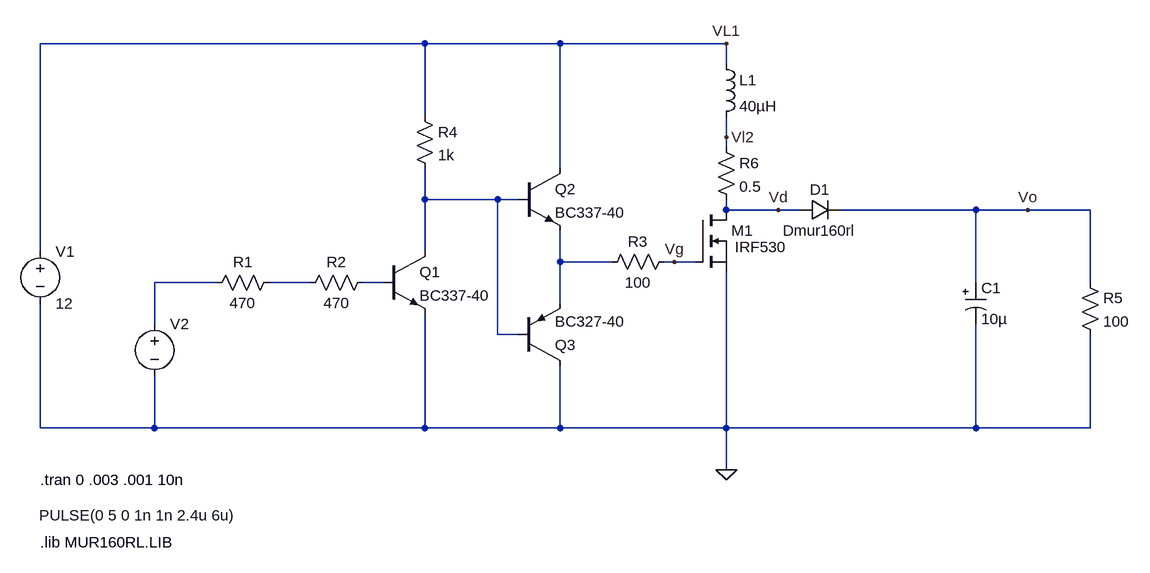
[diagram p0: schematic 3b.asc]
3b.asc, the LTspice schematic file:
Version 4
SHEET 1 1664 680
WIRE 544 -224 -48 -224
WIRE 752 -224 544 -224
WIRE 1008 -224 752 -224
WIRE 1008 -192 1008 -224
WIRE 544 -112 544 -224
WIRE 1008 -80 1008 -112
WIRE 1008 -64 1008 -80
WIRE 752 -32 752 -224
WIRE 544 16 544 -32
WIRE 656 16 544 16
WIRE 688 16 656 16
WIRE 1008 32 1008 16
WIRE 1088 32 1008 32
WIRE 1120 32 1088 32
WIRE 1392 32 1184 32
WIRE 1472 32 1392 32
WIRE 1568 32 1472 32
WIRE 1008 48 1008 32
WIRE -48 96 -48 -224
WIRE 544 96 544 16
WIRE 752 112 752 64
WIRE 832 112 752 112
WIRE 928 112 912 112
WIRE 960 112 928 112
WIRE 224 144 128 144
WIRE 368 144 304 144
WIRE 480 144 448 144
WIRE 1392 144 1392 32
WIRE 1568 144 1568 32
WIRE 752 176 752 112
WIRE 128 208 128 144
WIRE 656 224 656 16
WIRE 688 224 656 224
WIRE -48 368 -48 176
WIRE 128 368 128 288
WIRE 128 368 -48 368
WIRE 544 368 544 192
WIRE 544 368 128 368
WIRE 752 368 752 272
WIRE 752 368 544 368
WIRE 1008 368 1008 128
WIRE 1008 368 752 368
WIRE 1392 368 1392 208
WIRE 1392 368 1008 368
WIRE 1568 368 1568 224
WIRE 1568 368 1392 368
WIRE 1008 432 1008 368
FLAG 1008 432 0
FLAG 1008 -80 Vl2
FLAG 1472 32 Vo
FLAG 1008 -224 VL1
FLAG 928 112 Vg
FLAG 1088 32 Vd
SYMBOL voltage -48 80 R0
WINDOW 123 0 0 Left 0
WINDOW 39 0 0 Left 0
SYMATTR InstName V1
SYMATTR Value 12
SYMBOL voltage 128 192 R0
WINDOW 3 -178 310 Left 2
WINDOW 123 0 0 Left 0
WINDOW 39 0 0 Left 0
SYMATTR Value PULSE(0 5 0 1n 1n 2.4u 6u)
SYMATTR InstName V2
SYMBOL res 320 128 R90
WINDOW 0 0 56 VBottom 2
WINDOW 3 32 56 VTop 2
SYMATTR InstName R1
SYMATTR Value 470
SYMBOL res 464 128 R90
WINDOW 0 0 56 VBottom 2
WINDOW 3 32 56 VTop 2
SYMATTR InstName R2
SYMATTR Value 470
SYMBOL res 928 96 R90
WINDOW 0 0 56 VBottom 2
WINDOW 3 32 56 VTop 2
SYMATTR InstName R3
SYMATTR Value 100
SYMBOL res 528 -128 R0
SYMATTR InstName R4
SYMATTR Value 1k
SYMBOL res 1552 128 R0
SYMATTR InstName R5
SYMATTR Value 100
SYMBOL npn 480 96 R0
SYMATTR InstName Q1
SYMATTR Value BC337-40
SYMBOL npn 688 -32 R0
SYMATTR InstName Q2
SYMATTR Value BC337-40
SYMBOL pnp 688 272 M180
SYMATTR InstName Q3
SYMATTR Value BC327-40
SYMBOL diode 1120 48 R270
WINDOW 0 32 32 VTop 2
WINDOW 3 0 32 VBottom 2
SYMATTR InstName D1
SYMATTR Value Dmur160rl
SYMBOL polcap 1376 144 R0
WINDOW 3 24 56 Left 2
SYMATTR Value 10µ
SYMATTR InstName C1
SYMATTR Description Capacitor
SYMATTR Type cap
SYMATTR SpiceLine V=100 Irms=65m Rser=1.8 Lser=0 mfg="Nichicon" pn="UPR2A100MPH" type="Al electrolytic"
SYMBOL res 992 -80 R0
SYMATTR InstName R6
SYMATTR Value 0.5
SYMBOL ind 992 -208 R0
SYMATTR InstName L1
SYMATTR Value 40µH
SYMBOL nmos 960 32 R0
WINDOW 3 61 57 Left 2
SYMATTR Value IRF530
SYMATTR InstName M1
TEXT -48 448 Left 2 !.tran 0 .003 .001 10n
TEXT -48 544 Left 2 !.lib MUR160RL.LIB

The netlist it stands for:
* 3b.asc
V1 VL1 0 12
V2 N003 0 PULSE(0 5 0 1n 1n 2.4u 6u)
R1 N004 N003 470
R2 N005 N004 470
R3 Vg N002 100
R4 VL1 N001 1k
R5 Vo 0 100
Q1 N001 N005 0 0 BC337-40
Q2 VL1 N001 N002 0 BC337-40
Q3 0 N001 N002 0 BC327-40
D1 Vd Vo Dmur160rl
C1 Vo 0 10µ V=100 Irms=65m Rser=1.8 Lser=0 mfg="Nichicon" pn="UPR2A100MPH" type="Al electrolytic"
R6 Vl2 Vd 0.5
L1 VL1 Vl2 40µH
M1 Vd Vg 0 0 IRF530
.model D D
.lib standard.dio
.model NPN NPN
.model PNP PNP
.lib standard.bjt
.model NMOS NMOS
.model PMOS PMOS
.lib standard.mos
.tran 0 .003 .001 10n
.lib MUR160RL.LIB
.backanno
.end